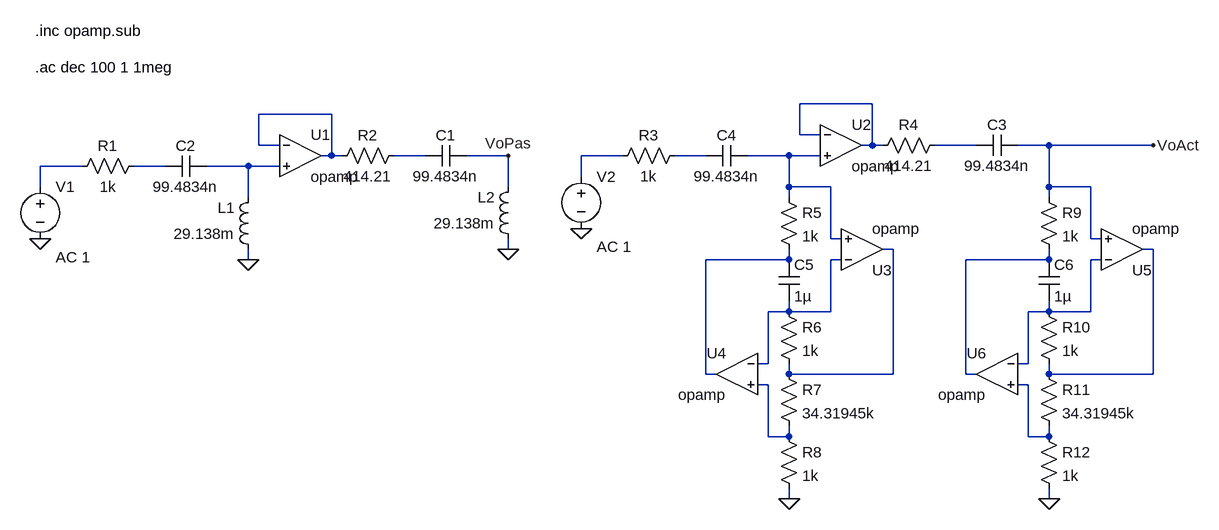
[diagram p0: schematic PasaAltos.asc]
PasaAltos.asc, the LTspice schematic file:
Version 4
SHEET 1 1732 696
WIRE 1216 -16 1104 -16
WIRE 384 0 272 0
WIRE 1104 32 1104 -16
WIRE 1136 32 1104 32
WIRE 272 48 272 0
WIRE 304 48 272 48
WIRE 1216 48 1216 -16
WIRE 1216 48 1200 48
WIRE 1232 48 1216 48
WIRE 1376 48 1312 48
WIRE 1488 48 1440 48
WIRE 1648 48 1488 48
WIRE 384 64 384 0
WIRE 384 64 368 64
WIRE 400 64 384 64
WIRE 528 64 480 64
WIRE 656 64 592 64
WIRE 832 64 768 64
WIRE 960 64 912 64
WIRE 1088 64 1024 64
WIRE 1136 64 1088 64
WIRE 0 80 -64 80
WIRE 128 80 80 80
WIRE 256 80 192 80
WIRE 304 80 256 80
WIRE 768 96 768 64
WIRE -64 112 -64 80
WIRE 656 112 656 64
WIRE 1088 112 1088 64
WIRE 1152 112 1088 112
WIRE 1488 112 1488 48
WIRE 1552 112 1488 112
WIRE 256 128 256 80
WIRE 1088 128 1088 112
WIRE 1488 128 1488 112
WIRE 1152 192 1152 112
WIRE 1168 192 1152 192
WIRE 1552 192 1552 112
WIRE 1568 192 1552 192
WIRE 656 208 656 192
WIRE 1248 208 1232 208
WIRE 1648 208 1632 208
WIRE 256 224 256 208
WIRE 1088 224 1088 208
WIRE 1088 224 960 224
WIRE 1168 224 1152 224
WIRE 1488 224 1488 208
WIRE 1488 224 1360 224
WIRE 1568 224 1552 224
WIRE 1088 304 1088 288
WIRE 1088 304 1056 304
WIRE 1152 304 1152 224
WIRE 1152 304 1088 304
WIRE 1488 304 1488 288
WIRE 1488 304 1456 304
WIRE 1552 304 1552 224
WIRE 1552 304 1488 304
WIRE 1056 384 1056 304
WIRE 1056 384 1040 384
WIRE 1456 384 1456 304
WIRE 1456 384 1440 384
WIRE 960 400 960 224
WIRE 976 400 960 400
WIRE 1088 400 1088 384
WIRE 1248 400 1248 208
WIRE 1248 400 1088 400
WIRE 1360 400 1360 224
WIRE 1376 400 1360 400
WIRE 1488 400 1488 384
WIRE 1648 400 1648 208
WIRE 1648 400 1488 400
WIRE 1056 416 1040 416
WIRE 1456 416 1440 416
WIRE 1056 496 1056 416
WIRE 1088 496 1088 480
WIRE 1088 496 1056 496
WIRE 1456 496 1456 416
WIRE 1488 496 1488 480
WIRE 1488 496 1456 496
WIRE 1088 592 1088 576
WIRE 1488 592 1488 576
FLAG 256 224 0
FLAG 656 208 0
FLAG -64 192 0
FLAG 768 176 0
FLAG 1088 592 0
FLAG 1488 592 0
FLAG 1648 48 VoAct
FLAG 656 64 VoPas
SYMBOL res 96 64 R90
WINDOW 0 0 56 VBottom 2
WINDOW 3 32 56 VTop 2
SYMATTR InstName R1
SYMATTR Value 1k
SYMBOL ind 272 224 R180
WINDOW 0 36 80 Left 2
WINDOW 3 36 40 Left 2
SYMATTR InstName L1
SYMATTR Value 29.138m
SYMBOL cap 592 48 R90
WINDOW 0 0 32 VBottom 2
WINDOW 3 32 32 VTop 2
SYMATTR InstName C1
SYMATTR Value 99.4834n
SYMBOL res 496 48 R90
WINDOW 0 0 56 VBottom 2
WINDOW 3 32 56 VTop 2
SYMATTR InstName R2
SYMATTR Value 414.21
SYMBOL ind 672 208 R180
WINDOW 0 36 80 Left 2
WINDOW 3 36 40 Left 2
SYMATTR InstName L2
SYMATTR Value 29.138m
SYMBOL cap 192 64 R90
WINDOW 0 0 32 VBottom 2
WINDOW 3 32 32 VTop 2
SYMATTR InstName C2
SYMATTR Value 99.4834n
SYMBOL OpAmps\\opamp 336 0 R0
SYMATTR InstName U1
SYMBOL voltage -64 96 R0
WINDOW 123 24 124 Left 2
WINDOW 39 0 0 Left 0
SYMATTR Value2 AC 1
SYMATTR InstName V1
SYMATTR Value ""
SYMBOL res 928 48 R90
WINDOW 0 0 56 VBottom 2
WINDOW 3 32 56 VTop 2
SYMATTR InstName R3
SYMATTR Value 1k
SYMBOL cap 1440 32 R90
WINDOW 0 0 32 VBottom 2
WINDOW 3 32 32 VTop 2
SYMATTR InstName C3
SYMATTR Value 99.4834n
SYMBOL res 1328 32 R90
WINDOW 0 0 56 VBottom 2
WINDOW 3 32 56 VTop 2
SYMATTR InstName R4
SYMATTR Value 414.21
SYMBOL cap 1024 48 R90
WINDOW 0 0 32 VBottom 2
WINDOW 3 32 32 VTop 2
SYMATTR InstName C4
SYMATTR Value 99.4834n
SYMBOL OpAmps\\opamp 1168 -16 R0
SYMATTR InstName U2
SYMBOL voltage 768 80 R0
WINDOW 123 24 124 Left 2
WINDOW 39 0 0 Left 0
SYMATTR Value2 AC 1
SYMATTR InstName V2
SYMATTR Value ""
SYMBOL res 1072 112 R0
SYMATTR InstName R5
SYMATTR Value 1k
SYMBOL res 1072 288 R0
SYMATTR InstName R6
SYMATTR Value 1k
SYMBOL res 1072 384 R0
SYMATTR InstName R7
SYMATTR Value 34.31945k
SYMBOL res 1072 480 R0
SYMATTR InstName R8
SYMATTR Value 1k
SYMBOL cap 1072 224 R0
SYMATTR InstName C5
SYMATTR Value 1µ
SYMBOL OpAmps\\opamp 1200 272 M180
SYMATTR InstName U3
SYMBOL OpAmps\\opamp 1008 336 M0
SYMATTR InstName U4
SYMBOL res 1472 112 R0
SYMATTR InstName R9
SYMATTR Value 1k
SYMBOL res 1472 288 R0
SYMATTR InstName R10
SYMATTR Value 1k
SYMBOL res 1472 384 R0
SYMATTR InstName R11
SYMATTR Value 34.31945k
SYMBOL res 1472 480 R0
SYMATTR InstName R12
SYMATTR Value 1k
SYMBOL cap 1472 224 R0
SYMATTR InstName C6
SYMATTR Value 1µ
SYMBOL OpAmps\\opamp 1600 272 M180
SYMATTR InstName U5
SYMBOL OpAmps\\opamp 1408 336 M0
SYMATTR InstName U6
TEXT -72 -128 Left 2 !.inc opamp.sub
TEXT -72 -72 Left 2 !.ac dec 100 1 1meg

The netlist it stands for:
* PasaAltos.asc
R1 N009 N008 1k
L1 0 N010 29.138m
C1 VoPas N004 99.4834n
R2 N004 N002 414.21
L2 0 VoPas 29.138m
C2 N010 N009 99.4834n
XU1 N002 N010 N002 opamp Aol=100K GBW=10Meg  ; pins invin noninvin out
V1 N008 0 AC 1
R3 N006 N005 1k
C3 VoAct N003 99.4834n
R4 N003 N001 414.21
C4 N007 N006 99.4834n
XU2 N001 N007 N001 opamp Aol=100K GBW=10Meg  ; pins invin noninvin out
V2 N005 0 AC 1
R5 N007 N013 1k
R6 N014 N011 1k
R7 N011 N017 34.31945k
R8 N017 0 1k
C5 N013 N014 1µ
XU3 N014 N007 N011 opamp Aol=100K GBW=10Meg  ; pins invin noninvin out
XU4 N014 N017 N013 opamp Aol=100K GBW=10Meg  ; pins invin noninvin out
R9 VoAct N015 1k
R10 N016 N012 1k
R11 N012 N018 34.31945k
R12 N018 0 1k
C6 N015 N016 1µ
XU5 N016 VoAct N012 opamp Aol=100K GBW=10Meg  ; pins invin noninvin out
XU6 N016 N018 N015 opamp Aol=100K GBW=10Meg  ; pins invin noninvin out
.inc opamp.sub
.ac dec 100 1 1meg
.backanno
.end

* Results of the author's LTspice run, read from the files saved beside the schematic
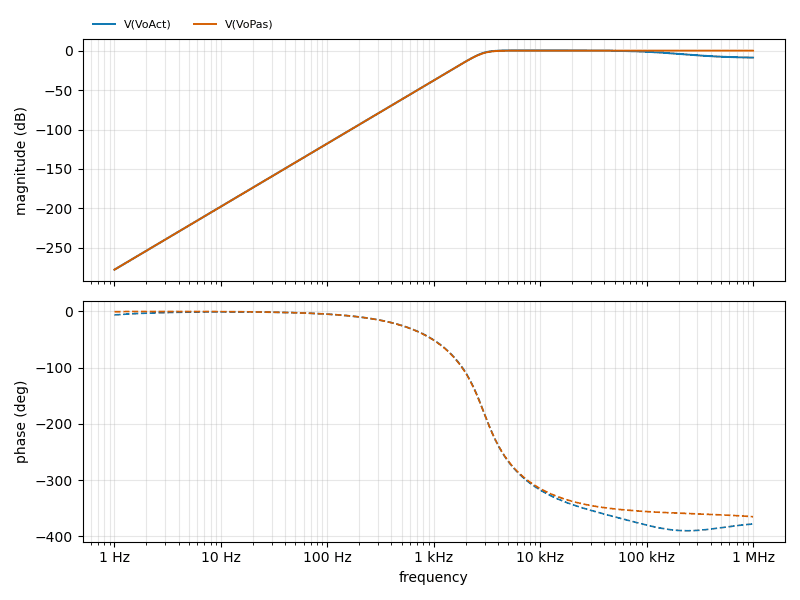
[diagram p1: AC Analysis of PasaAltos.asc, plotted from the saved traces]
* AC Analysis, 1 run:
*   V(VoAct): -277.61 dB at 1 Hz, -8.83 dB at 1 MHz, peak 0.29 dB at 9.12 kHz, 3 dB below the peak at 2.959 kHz and 144.5 kHz
*   V(VoPas): -277.66 dB at 1 Hz, -0.04 dB at 1 MHz, peak -0.00 dB at 17.38 kHz, 3 dB below the peak at 2.956 kHz